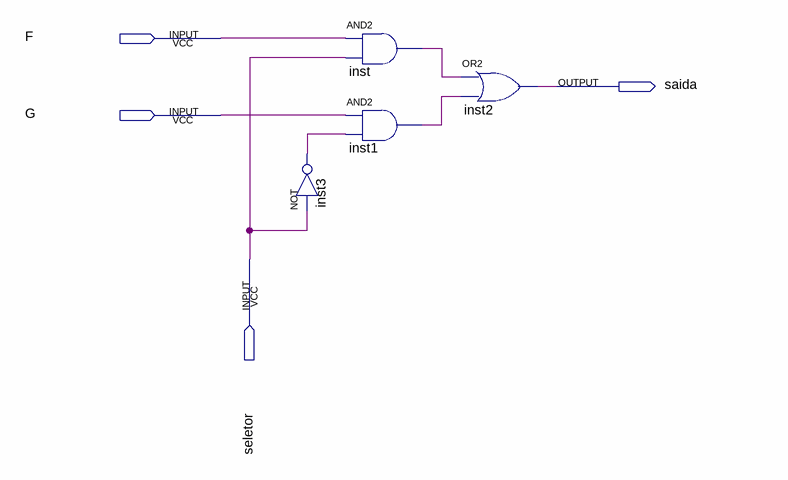
[diagram p0: schematic sheet]
// Quartus schematic Mux2x1.bdf as structural Verilog: 4 symbols, 4 pins
module Mux2x1 (
  input  F,
  input  G,
  input  seletor,
  output saida
);

  wire inst1_out, inst3_out, inst_out;

  and inst (inst_out, F, seletor);
  and inst1 (inst1_out, G, inst3_out);
  not inst3 (inst3_out, seletor);
  or inst2 (saida, inst_out, inst1_out);
endmodule
